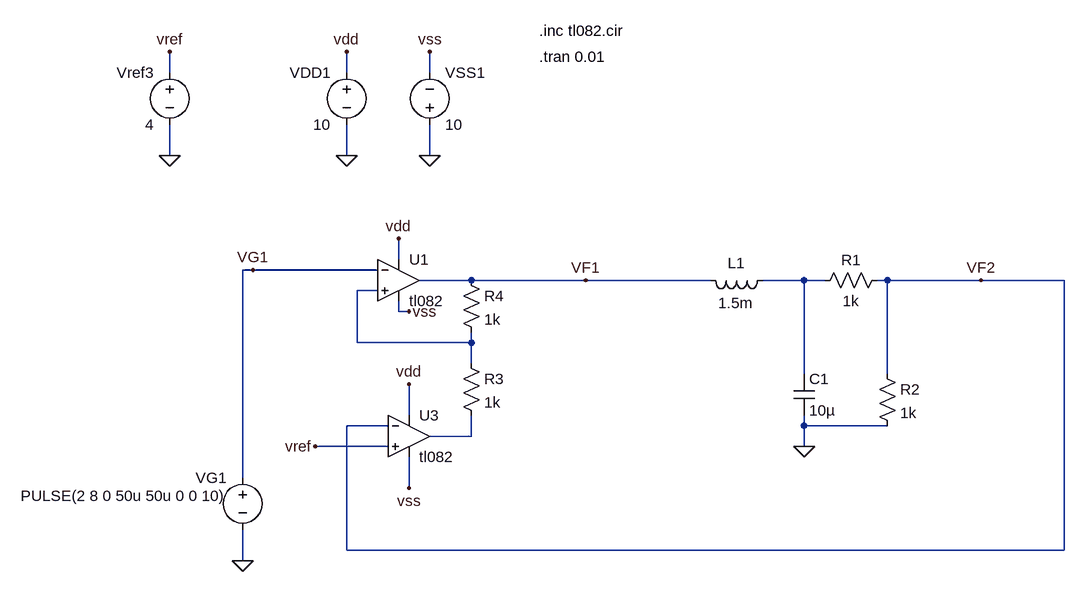
[diagram p0: schematic 9_1_2.asc]
9_1_2.asc, the LTspice schematic file:
Version 4
SHEET 1 1204 680
WIRE -176 -208 -176 -240
WIRE 96 -208 96 -240
WIRE 224 -208 224 -240
WIRE -176 -80 -176 -128
WIRE 96 -80 96 -128
WIRE 224 -80 224 -128
WIRE 176 80 176 48
WIRE -48 96 -64 96
WIRE 144 96 -48 96
WIRE 288 112 208 112
WIRE 464 112 288 112
WIRE 656 112 464 112
WIRE 800 112 736 112
WIRE 832 112 800 112
WIRE 928 112 912 112
WIRE 1072 112 928 112
WIRE 1200 112 1072 112
WIRE 144 128 112 128
WIRE 176 160 176 144
WIRE 192 160 176 160
WIRE 112 208 112 128
WIRE 288 208 288 192
WIRE 288 208 112 208
WIRE 288 240 288 208
WIRE 800 256 800 112
WIRE 928 256 928 112
WIRE 192 320 192 272
WIRE 160 336 96 336
WIRE 800 336 800 320
WIRE 928 336 800 336
WIRE 288 352 288 320
WIRE 288 352 224 352
WIRE 160 368 48 368
WIRE 800 368 800 336
WIRE -64 416 -64 96
WIRE 192 432 192 384
WIRE 96 528 96 336
WIRE 1200 528 1200 112
WIRE 1200 528 96 528
WIRE -64 544 -64 496
FLAG 192 160 vss
FLAG 800 368 0
FLAG -64 544 0
FLAG 96 -80 0
FLAG 224 -80 0
FLAG 96 -240 vdd
FLAG 224 -240 vss
FLAG -176 -80 0
FLAG -176 -240 vref
FLAG 176 48 vdd
FLAG 192 272 vdd
FLAG 192 432 vss
FLAG 48 368 vref
FLAG 464 112 VF1
FLAG 1072 112 VF2
FLAG -48 96 VG1
SYMBOL voltage -64 400 M0
WINDOW 123 0 0 Left 2
WINDOW 39 0 0 Left 2
WINDOW 3 24 44 Left 2
SYMATTR Value PULSE(2 8 0 50u 50u 0 0 10)
SYMATTR InstName VG1
SYMBOL Opamps\\opamp2 176 48 R0
SYMATTR InstName U1
SYMATTR Value tl082
SYMBOL ind 752 96 R90
WINDOW 0 5 56 VBottom 2
WINDOW 3 35 57 VTop 2
SYMATTR InstName L1
SYMATTR Value 1.5m
SYMBOL cap 784 256 R0
SYMATTR InstName C1
SYMATTR Value 10µ
SYMBOL res 912 240 R0
SYMATTR InstName R2
SYMATTR Value 1k
SYMBOL Opamps\\opamp2 192 288 R0
SYMATTR InstName U3
SYMATTR Value tl082
SYMBOL voltage 96 -224 M0
SYMATTR InstName VDD1
SYMATTR Value 10
SYMBOL voltage -176 -224 M0
WINDOW 123 0 0 Left 2
WINDOW 39 0 0 Left 2
SYMATTR InstName Vref3
SYMATTR Value 4
SYMBOL voltage 224 -112 M180
WINDOW 0 24 96 Left 2
WINDOW 3 24 16 Left 2
SYMATTR InstName VSS1
SYMATTR Value 10
SYMBOL res 928 96 R90
WINDOW 0 0 56 VBottom 2
WINDOW 3 32 56 VTop 2
SYMATTR InstName R1
SYMATTR Value 1k
SYMBOL res 272 96 R0
SYMATTR InstName R4
SYMATTR Value 1k
SYMBOL res 272 224 R0
SYMATTR InstName R3
SYMATTR Value 1k
TEXT 392 -272 Left 2 !.inc tl082.cir
TEXT 392 -232 Left 2 !.tran 0.01

The netlist it stands for:
* 9_1_2.asc
VG1 VG1 0 PULSE(2 8 0 50u 50u 0 0 10)
XU1 N002 VG1 vdd vss VF1 tl082  ; pins In+ In- V+ V- OUT
L1 N001 VF1 1.5m
C1 N001 0 10µ
R2 VF2 0 1k
XU3 vref VF2 vdd vss N003 tl082  ; pins In+ In- V+ V- OUT
VDD1 vdd 0 10
Vref3 vref 0 4
VSS1 0 vss 10
R1 VF2 N001 1k
R4 VF1 N002 1k
R3 N002 N003 1k
.inc tl082.cir
.tran 0.01
.backanno
.end